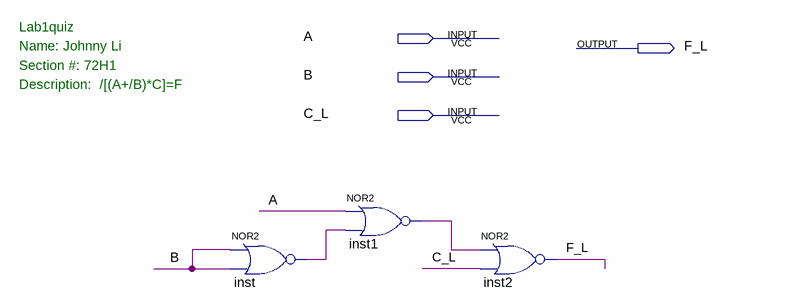
[diagram p0: schematic sheet]
// Quartus schematic lab1quiz.bdf as structural Verilog: 3 symbols, 4 pins
module lab1quiz (
  input  A,
  input  B,
  input  C_L,
  output F_L
);

  wire inst1_out, inst_out;

  nor inst (inst_out, B, B);
  nor inst1 (inst1_out, A, inst_out);
  nor inst2 (F_L, inst1_out, C_L);

  // Notes on the sheet:
  //   Lab1quiz
  //   Name: Johnny Li
  //   Section #: 72H1
  //   Description:  /[(A+/B)*C]=F
endmodule
